# EAGLE design analog (EAGLE 6.5.0)
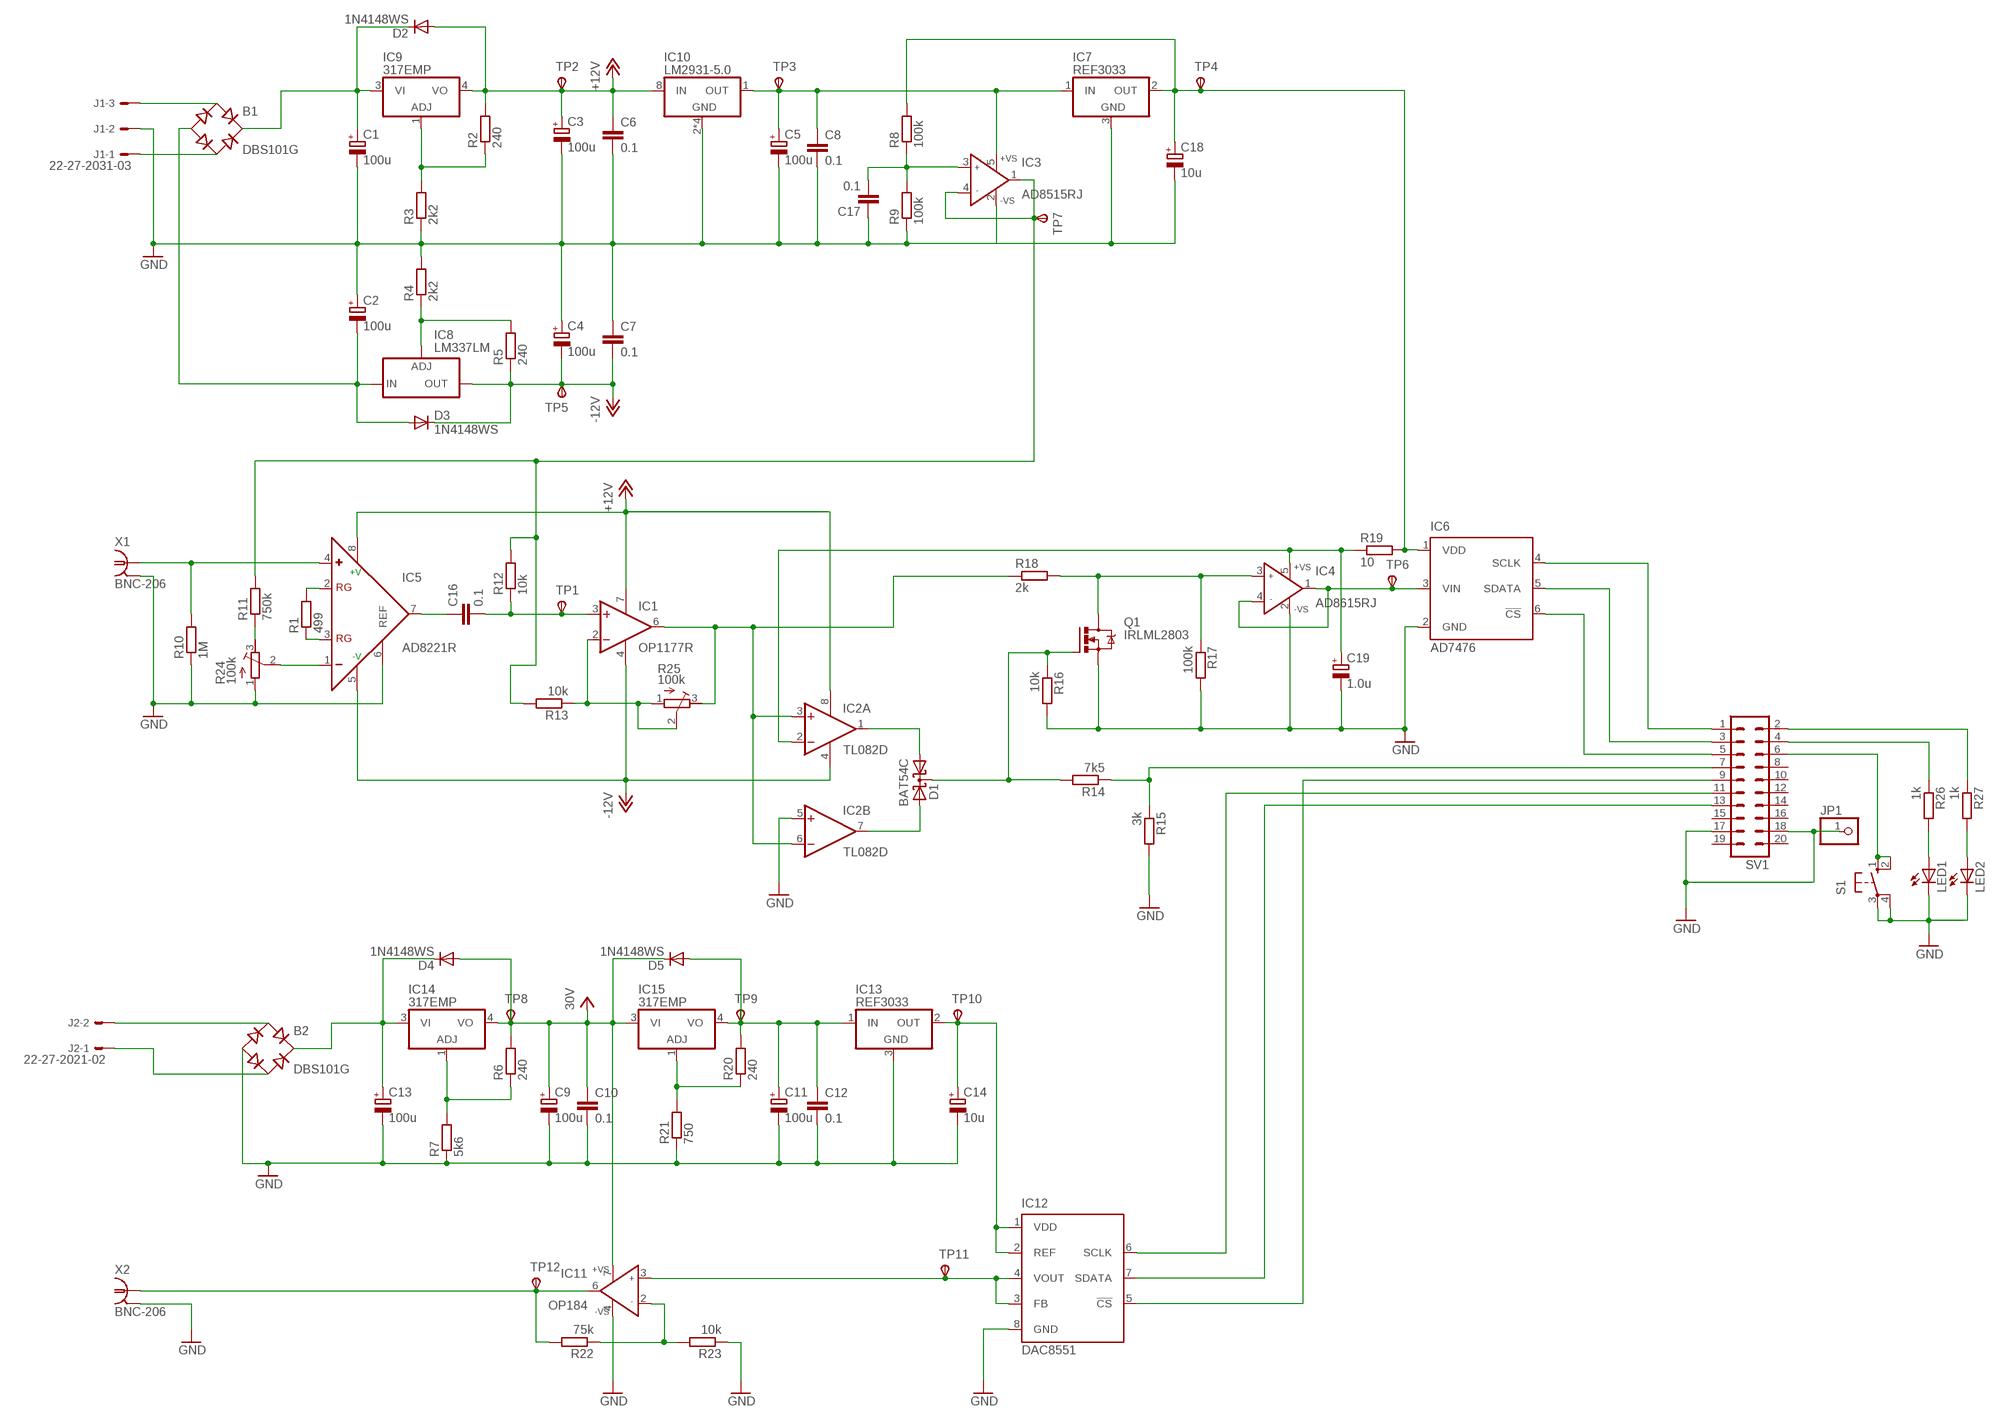
[diagram p0: schematic, sheet 1]

## Parts
B1  DBS101G  [DBS]
B2  DBS101G  [DBS]
C1  100u  CPOL-EUE3.5-8  [E3,5-8]
C2  100u  CPOL-EUE3.5-8  [E3,5-8]
C3  100u  CPOL-EUE2.5-6  [E2,5-6]
C4  100u  CPOL-EUE2.5-6  [E2,5-6]
C5  100u  CPOL-EUE2.5-5  [E2,5-5]
C6  0.1  C-EUC0805K  [C0805K]
C7  0.1  C-EUC0805K  [C0805K]
C8  0.1  C-EUC0603  [C0603]
C9  100u  CPOL-EUE2.5-6  [E2,5-6]
C10  0.1  C-EUC0805K  [C0805K]
C11  100u  CPOL-EUE2.5-5  [E2,5-5]
C12  0.1  C-EUC0603  [C0603]
C13  100u  CPOL-EUE3.5-8  [E3,5-8]
C14  10u  CPOL-EUSMCA  [SMC_A]
C16  0.1  C-EUC0603  [C0603]
C17  0.1  C-EUC0603  [C0603]
C18  10u  CPOL-EUSMCA  [SMC_A]
C19  1.0u  CPOL-EUSMCA  [SMC_A]
D1  BAT54C  [SOT23]
D2  1N4148WS  [SOD323]
D3  1N4148WS  [SOD323]
D4  1N4148WS  [SOD323]
D5  1N4148WS  [SOD323]
IC1  OP1177R  [SOIC8]
IC2  TL082D  [SO08]
IC3  AD8515RJ  [SOT23-5]
IC4  AD8615RJ  [SOT23-5]
IC5  AD8221R  [SO8@1]
IC6  AD7476  [SOT23-6]
IC7  REF3033  [SOT23]
IC8  LM337LM  [SO8]
IC9  317EMP  [SOT223]
IC10  LM2931-5.0  [SO8]
IC11  OP184  [SO8]
IC12  DAC8551  [MSOP8]
IC13  REF3033  [SOT23]
IC14  317EMP  [SOT223]
IC15  317EMP  [SOT223]
J1  22-27-2031-03  [6410-03]
J2  22-27-2021-02  [6410-02]
JP1  PINHD-1X1  [1X01]
LED1  LEDCHIPLED_0805  [CHIPLED_0805]
LED2  LEDCHIPLED_0805  [CHIPLED_0805]
Q1  IRLML2803  [SOT23]
R1  499  R-EU_R0805  [R0805]
R2  240  R-EU_R0805  [R0805]
R3  2k2  R-EU_R0805  [R0805]
R4  2k2  R-EU_R0805  [R0805]
R5  240  R-EU_R0805  [R0805]
R6  240  R-EU_R0805  [R0805]
R7  5k6  R-EU_R0805  [R0805]
R8  100k  R-EU_R0603  [R0603]
R9  100k  R-EU_R0603  [R0603]
R10  1M  R-EU_R0603  [R0603]
R11  750k  R-EU_R0603  [R0603]
R12  10k  R-EU_R0603  [R0603]
R13  10k  R-EU_R0603  [R0603]
R14  7k5  R-EU_R0603  [R0603]
R15  3k  R-EU_R0603  [R0603]
R16  10k  R-EU_R0603  [R0603]
R17  100k  R-EU_R0603  [R0603]
R18  2k  R-EU_R0603  [R0603]
R19  10  R-EU_R0603  [R0603]
R20  240  R-EU_R0603  [R0603]
R21  750  R-EU_R0603  [R0603]
R22  75k  R-EU_R0603  [R0603]
R23  10k  R-EU_R0603  [R0603]
R24  100k  R-TRIMM3296W  [RTRIM3296W]
R25  100k  R-TRIMM3296W  [RTRIM3296W]
R26  1k  R-EU_R0603  [R0603]
R27  1k  R-EU_R0603  [R0603]
S1  10-XX  [B3F-10XX]
SV1  MA10-2W  [MA10-2W]
TP1  TPSB2,54  [B2,54]
TP2  TPSB2,54  [B2,54]
TP3  TPSB2,54  [B2,54]
TP4  TPSB2,54  [B2,54]
TP5  TPSB2,54  [B2,54]
TP6  TPSB2,54  [B2,54]
TP7  TPSB2,54  [B2,54]
TP8  TPSB2,54  [B2,54]
TP9  TPSB2,54  [B2,54]
TP10  TPSB2,54  [B2,54]
TP11  TPSB2,54  [B2,54]
TP12  TPSB2,54  [B2,54]
X1  BNC-206  1-227161-0  [AMP_227161]
X2  BNC-206  1-227161-0  [AMP_227161]

## Nets
30V: C9.+ C10.1 D4.2(A) D5.1(C) IC11.7(+VS) IC14.4(VO) IC15.3(VI) R6.2 TP8.TP(PP)
+3.3V: C18.+ IC6.1(VDD) IC7.2(OUT) R8.2 R19.2 TP4.TP(PP)
+5V: C5.+ C8.1 IC3.5(+VS) IC7.1(IN) IC10.1(OUT) TP3.TP(PP)
+12V: C3.+ C6.1 D2.2(A) IC1.7(V+) IC2.8(P:V+) IC5.8(+V) IC9.4(VO) IC10.8(IN) R2.2 TP2.TP(PP)
-12V: C4.- C7.2 D3.1(C) IC1.4(V-) IC2.4(P:V-) IC5.5(-V) IC8.1(OUT) R5.1 TP5.TP(PP)
GND: B2.- C1.- C2.+ C3.- C4.+ C5.- C6.2 C7.1 C8.2 C9.- C10.2 C11.- C12.2 C13.- C14.- C17.1 C18.- C19.- IC2.5(B:+IN) IC3.2(-VS) IC4.2(-VS) IC5.6(REF) IC6.2(GND) IC7.3(GND) IC10.2(GND) IC10.3(GND) IC10.6(GND) IC10.7(GND) IC11.4(-VS) IC12.8(GND) IC13.3(GND) J1.2 JP1.1 LED1.C LED2.C Q1.2(S) R3.1 R4.2 R7.1 R9.1 R10.1 R15.2 R16.2 R17.2 R21.1 R23.1 R24.1(A) S1.3(P) S1.4(P1) SV1.17 SV1.18 X1.2 X2.2
N$1: IC4.1(OUT) IC4.4(IN-) IC6.3(VIN) TP6.TP(PP)
N$2: IC4.3(IN+) Q1.3(D) R17.1 R18.2
N$3: B1.- C2.- D3.2(A) IC8.2(IN) IC8.3(IN) IC8.6(IN) IC8.7(IN)
N$4: D1.1(A1) IC2.1(A:OUT)
N$5: D1.3(CC) Q1.1(G) R14.2 R16.1
N$6: D1.2(A2) IC2.7(B:OUT)
N$7: R26.1 SV1.4
N$8: R14.1 R15.1 SV1.7
N$9: IC1.6(OUT) IC2.3(A:+IN) IC2.6(B:-IN) R18.1 R25.3(E)
N$10: IC5.2(RG) R1.2
N$11: IC5.3(RG) R1.1
N$12: C16.1 IC5.7(OUT)
N$13: IC1.2(-IN) R13.1 R25.1(A) R25.2(S)
N$14: IC6.4(SCLK) SV1.1
N$15: C16.2 IC1.3(+IN) R12.1 TP1.TP(PP)
N$16: LED1.A R26.2
N$17: IC5.1(-) R24.2(S)
N$18: R11.1 R24.3(E)
N$19: IC5.4(+) R10.2 X1.1
N$20: LED2.A R27.2
N$21: IC6.5(SDATA) SV1.3
N$22: IC6.6(!CS) SV1.5
N$23: B2.AC1 J2.2
N$24: IC8.4(ADJ) R4.1 R5.2
N$25: IC9.1(ADJ) R2.1 R3.2
N$26: R27.1 SV1.2
N$27: C19.+ IC2.2(A:-IN) IC4.5(+VS) R19.1
N$29: IC3.1(OUT) IC3.4(IN-) R11.2 R12.2 R13.2 TP7.TP(PP)
N$30: C17.2 IC3.3(IN+) R8.1 R9.2
N$31: B2.+ C13.+ D4.1(C) IC14.3(VI)
N$32: C11.+ C12.1 D5.2(A) IC13.1(IN) IC15.4(VO) R20.2 TP9.TP(PP)
N$33: IC14.1(ADJ) R6.1 R7.2
N$35: B1.AC1 J1.3
N$36: B1.AC2 J1.1
N$37: IC15.1(ADJ) R20.1 R21.2
N$38: B1.+ C1.+ D2.1(C) IC9.3(VI)
N$39: C14.+ IC12.1(VDD) IC12.2(REF) IC13.2(OUT) TP10.TP(PP)
N$40: IC12.6(SCLK) SV1.11
N$41: IC11.6(OUT) R22.2 TP12.TP(PP) X2.1
N$42: IC12.7(SDATA) SV1.13
N$44: IC11.2(IN-) R22.1 R23.2
N$45: IC12.5(!CS) SV1.9
N$47: IC11.3(IN+) IC12.3(FB) IC12.4(VOUT) TP11.TP(PP)
N$51: B2.AC2 J2.1
N$55: S1.1(S) S1.2(S1) SV1.6
Unconnected: SV1.8 SV1.10 SV1.12 SV1.14 SV1.15 SV1.16 SV1.19 SV1.20

## Library data of the parts
B1 B2 = rectifier:DB?*G: Single Phase 1.0 AMP Glass Passivated Bridge Rectifier Taiwan Semiconductor Co.,Ltd. - TSC Source: http://www.taiwansemi.com/TSCbig5/ezcatfiles/cust/img/img/db101g.pdf http://www.ts.com.tw/db/pictures/modules/PDT/PDT060207001/DBLS201G.pdf
C1-C5 C9 C11 C13 C14 C18 C19 = rcl:CPOL-EU: POLARIZED CAPACITOR, European symbol
C6-C8 C10 C12 C16 C17 = rcl:C-EU: CAPACITOR, European symbol
D1 = diode:BAT54C: Schottky Diodes Source: Fairchild .. BAT54.pdf
D2-D5 = afc-smm:1N4148: DIODE high speed (Philips)
IC1 = linear:OP1177: Precision Low Noise, Low Input Bias Current Operational Amplifiers Source: OP1177_2177_4177.pdf
IC2 = linear:TL082: OP AMP
IC3 = afc-smm:AD8515: General-Purpose CMOS Rail-to-Rail Amplifiers Source: http://www.analog.com/static/imported-files/data_sheets/AD8515.pdf; MF: Analog Devices; MPN: AD8515ARTZ-REEL7; OC_FARNELL: 1464963; OC_NEWARK: 88H0268
IC4 = afc-smm:AD8615: Precission 20 MHz CMOS Rail-to-Rail Amplifiers Source: http://www.analog.com/static/imported-files/data_sheets/AD8615_8616_8618.pdf; MF: ALTERA CORPORATION; MPN: AD8541ARTZ-REEL7; OC_FARNELL: 1464963; OC_NEWARK: 88H0268
IC5 = afc-smm:AD8221: Precision Instrumentation Amplifier; MPN: AD8221; OC_FARNELL: 1464424; OC_NEWARK: 05F7109
IC6 = afc-smm:AD7476
IC7 IC13 = afc-smm:REF3033
IC8 = afc-smm:LM337L: VOLTAGE REGULATOR
IC9 IC14 IC15 = linear:*317: Positive VOLTAGE REGULATOR
IC10 = afc-smm:LM2931-5.0
IC11 = afc-smm:OP184
IC12 = afc-smm:DAC8551
J1 = con-molex:22-?-03: CONNECTOR wire to board 2.54 mm (.1 inch) pitch header; OC_FARNELL: unknown; OC_NEWARK: unknown
J2 = con-molex:22-?-02: CONNECTOR wire to board 2.54 mm (.1 inch) pitch header; OC_FARNELL: unknown; OC_NEWARK: unknown
JP1 = afc-smm:PINHD-1X1: PIN HEADER
LED1 LED2 = led:LED: LED OSRAM: - CHIPLED LG R971, LG N971, LY N971, LG Q971, LY Q971, LO R971, LY R971 LH N974, LH R974 LS Q976, LO Q976, LY Q976 LO Q996 - Hyper CHIPLED LW Q18S LB Q993, LB Q99A, LB R99A - SideLED LS A670, LO A670, LY A670, LG A670, LP A670 LB A673, LV A673, LT A673, LW A673 LH A674 LY A675 LS A676, LA A676, LO A676, LY A676, LW A676 LS A679, LY A679, LG A679 - Hyper Micro SIDELED® LS Y876, LA Y876, LO Y876, LY Y876 LT Y87S - SmartLED LW L88C, LW L88S LB L89C, LB L89S, LG L890 LS L89K, LO L89K, LY L89K LS L896, LA L896, LO L896, LY L896 - TOPLED LS T670, LO T670, LY T670, LG T670, LP T670 LSG T670, LSP T670, LSY T670, LOP T670, LYG T670 LG T671, LOG T671, LSG T671 LB T673, LV T673, LT T673, LW T673 LH T674 LS T676, LA T676, LO T676, LY T676, LB T676, LH T676, LSB T676, LW T676 LB T67C, LV T67C, LT T67C, LS T67K, LO T67K, LY T67K, LW E67C LS E67B, LA E67B, LO E67B, LY E67B, LB E67C, LV E67C, LT E67C LW T67C LS T679, LY T679, LG T679 LS T770, LO T770, LY T770, LG T770, LP T770 LB T773, LV T773, LT T773, LW T773 LH T774 LS E675, LA E675, LY E675, LS T675 LS T776, LA T776, LO T776, LY T776, LB T776 LHGB T686 LT T68C, LB T68C - Hyper Mini TOPLED® LB M676 - Mini TOPLED Santana® LG M470 LS M47K, LO M47K, LY M47K Source: http://www.osram.convergy.de LUXEON: - LUMILED® LXK2-PW12-R00, LXK2-PW12-S00, LXK2-PW14-U00, LXK2-PW14-V00 LXK2-PM12-R00, LXK2-PM12-S00, LXK2-PM14-U00 LXK2-PE12-Q00, LXK2-PE12-R00, LXK2-PE12-S00, LXK2-PE14-T00, LXK2-PE14-U00 LXK2-PB12-K00, LXK2-PB12-L00, LXK2-PB12-M00, LXK2-PB14-N00, LXK2-PB14-P00, LXK2-PB14-Q00 LXK2-PR12-L00, LXK2-PR12-M00, LXK2-PR14-Q00, LXK2-PR14-R00 LXK2-PD12-Q00, LXK2-PD12-R00, LXK2-PD12-S00 LXK2-PH12-R00, LXK2-PH12-S00 LXK2-PL12-P00, LXK2-PL12-Q00, LXK2-PL12-R00 Source: www.luxeon.com KINGBRIGHT: KA-3528ASYC Source: www.kingbright.com
Q1 = afc-smm:IRLML2803
R1-R23 R26 R27 = rcl:R-EU_: RESISTOR, European symbol
R24 R25 = afc-smm:R-TRIMM: Trimm resistor
S1 = switch-omron:10-XX: OMRON SWITCH; MPN: B3F-1000; OC_FARNELL: 176432; OC_NEWARK: 36M3542
SV1 = afc-smm:MA10-2W: PIN HEADER; OC_FARNELL: unknown; OC_NEWARK: unknown
TP1-TP12 = testpad:TPS: TEST PIN
X1 X2 = afc-smm:?227161*: JACK, RIGHT ANGLE, 50 OHM, PCB, BNC Source: amp_227161.pdf; MF: TYCO ELECTRONICS; MPN: 1-227161; OC_FARNELL: unknown; OC_NEWARK: 33B3200

## Board
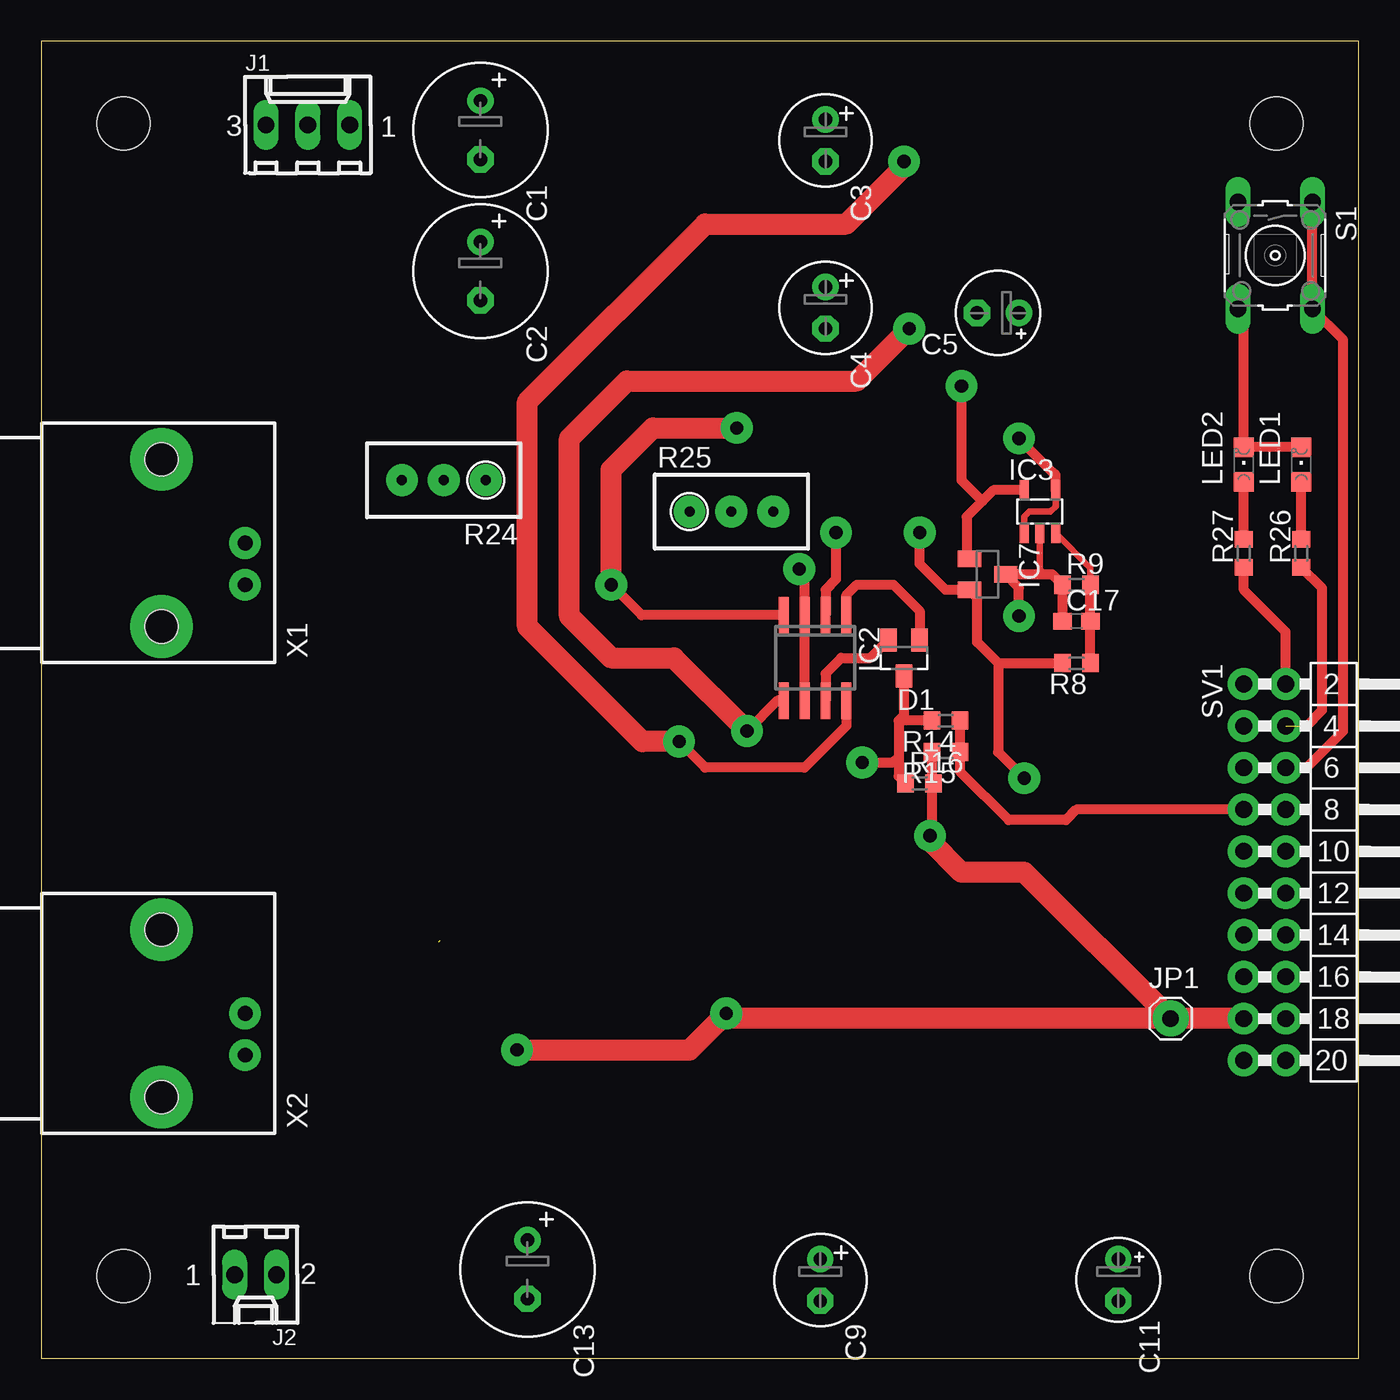
[diagram p1: board, top side]
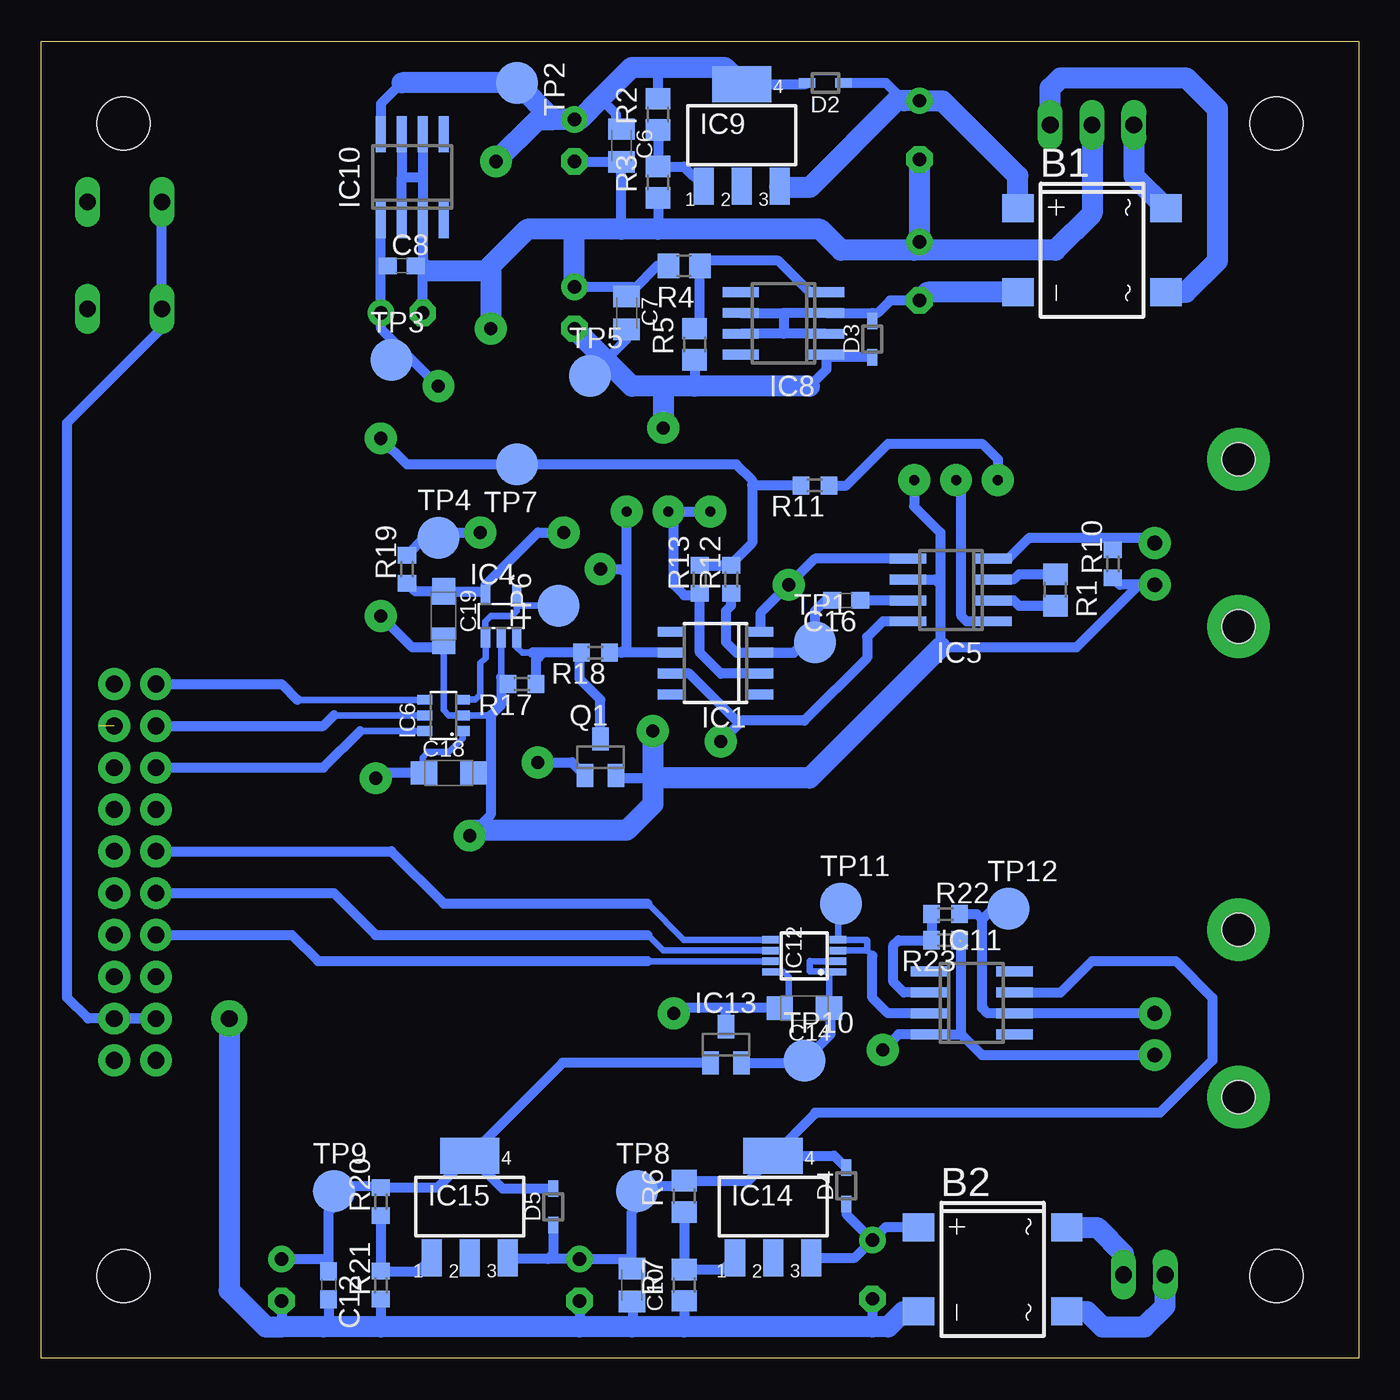
[diagram p2: board, bottom side, seen from below]

Size 80 x 80 mm. Coordinates in mm from the lower left corner, seen from the top.
Outline: 0,0 80,0 80,80 0,80 0,0
Copper layers (1*16): Top 0.035mm / dielectric 1.5mm / Bottom 0.035mm
Design rules "default *": minimum track width 0.3mm, minimum drill 0.6mm, track to track 0.3mm, track to pad 0.4mm, pad to pad 0.4mm, via to via 0.4mm, smd to smd 8mil, copper to edge 40mil, drill to drill 8mil, minimum pad ring 10mil, minimum via ring 8mil, stop-mask expansion 4mil, vias tented up to drill 0mil, thermal gap 10mil
Holes 3.2 mm at 5,5 75,5 75,75 5,75

### Footprints (pad centres in the part's own frame; a part is rotated, then mirrored left to right if it is on the bottom)
DBS = smd 1.7 x 1.9: + -2.55,-4.5; - 2.55,-4.5; AC1 -2.55,4.5; AC2 2.55,4.5
E3,5-8 = drill 0.813 pad 1.6: + -1.778,0 | drill 0.813 pad 1.6 octagon: - 1.778,0
E2,5-6 = drill 0.813 pad 1.6: + -1.27,0 | drill 0.813 pad 1.6 octagon: - 1.27,0
E2,5-5 = drill 0.813 pad 1.6: + -1.27,0 | drill 0.813 pad 1.6 octagon: - 1.27,0
C0805K = smd 1.3 x 1.6: 1 -1,0; 2 1,0
C0603 = smd 1.1 x 1: 1 -0.85,0; 2 0.85,0
SMC_A = smd 1.6 x 1.4: + -1.5,0; - 1.5,0
SOT23 = smd 1 x 1.4: 1 -0.95,-1.1; 2 0.95,-1.1; 3 0,1.1
SOD323 = smd 1 x 0.6: 1 -1.1,0; 2 1.1,0
SOIC8 = smd 0.6 x 1.5: 1 -1.905,-2.75; 2 -0.635,-2.75; 3 0.635,-2.75; 4 1.905,-2.75; 5 1.905,2.75; 6 0.635,2.75; 7 -0.635,2.75; 8 -1.905,2.75
SO08 = smd 0.6 x 2.2: 1 -1.905,-2.6; 2 -0.635,-2.6; 3 0.635,-2.6; 4 1.905,-2.6; 5 1.905,2.6; 6 0.635,2.6; 7 -0.635,2.6; 8 -1.905,2.6
SOT23-5 = smd 0.55 x 1.2: 1 -0.95,-1.3; 2 0,-1.3; 3 0.95,-1.3; 4 0.95,1.3; 5 -0.95,1.3
SO8@1 = smd 0.6 x 2.2: 1 -1.905,-2.6; 2 -0.635,-2.6; 3 0.635,-2.6; 4 1.905,-2.6; 5 1.905,2.6; 6 0.635,2.6; 7 -0.635,2.6; 8 -1.905,2.6
SOT23-6 = smd 0.6 x 0.9: 1 -0.95,-1.15; 2 0,-1.15; 3 0.95,-1.15; 4 0.95,1.15; 5 0,1.15; 6 -0.95,1.15
SO8 = smd 0.6 x 2.2: 1 -1.905,-2.6; 2 -0.635,-2.6; 3 0.635,-2.6; 4 1.905,-2.6; 5 1.905,2.6; 6 0.635,2.6; 7 -0.635,2.6; 8 -1.905,2.6
SOT223 = smd 1.219 x 2.235: 1 -2.311,-3.099; 2 0,-3.099; 3 2.311,-3.099 | smd 3.6 x 2.2: 4 0,3.099
MSOP8 = smd 0.45 x 1: 1 -0.975,-2.05; 2 -0.325,-2.05; 3 0.325,-2.05; 4 0.975,-2.05; 5 0.975,2.05; 6 0.325,2.05; 7 -0.325,2.05; 8 -0.975,2.05
6410-03 = drill 1.016 long: 1 2.54,0; 2 0,0; 3 -2.54,0
6410-02 = drill 1.016 long: 1 1.27,0; 2 -1.27,0
1X01 = drill 1.016 pad 2.184: 1 0,0
CHIPLED_0805 = smd 1.2 x 1.2: A 0,-1.05; C 0,1.05
R0805 = smd 1.3 x 1.5: 1 -0.95,0; 2 0.95,0
R0603 = smd 1 x 1.1: 1 -0.85,0; 2 0.85,0
RTRIM3296W = drill 0.61 pad 1.93: 1 0,-2.54; 2 0,0; 3 0,2.54
B3F-10XX = drill 1.016 long: 1 -3.251,2.261; 2 3.251,2.261; 3 -3.251,-2.261; 4 3.251,-2.261
MA10-2W = drill 1.016 pad 1.93: 1 -11.43,-1.27; 2 -11.43,1.27; 3 -8.89,-1.27; 4 -8.89,1.27; 5 -6.35,-1.27; 6 -6.35,1.27; 7 -3.81,-1.27; 8 -3.81,1.27; 9 -1.27,-1.27; 10 -1.27,1.27; 11 1.27,-1.27; 12 1.27,1.27; 13 3.81,-1.27; 14 3.81,1.27; 15 6.35,-1.27; 16 6.35,1.27; 17 8.89,-1.27; 18 8.89,1.27; 19 11.43,-1.27; 20 11.43,1.27
B2,54 = smd 2.54 x 2.54: TP 0,0
AMP_227161 = drill 0.9 pad 1.93: 1 0,-5.08; 2 -2.54,-5.08 | hole 2: -5.08,0; 5.08,0

### Placement (x,y rotation side)
B1  16.19,67.31 270 bottom
B2  22.23,5.4 270 bottom
C1  26.67,74.61 270 top
C2  26.67,66.04 270 top
C3  47.62,73.98 270 top
C4  47.62,63.82 270 top
C5  58.1,63.5 180 top
C6  44.77,73.66 270 bottom
C7  44.45,63.5 270 bottom
C8  58.1,66.36 0 bottom
C9  47.31,4.76 270 top
C10  44.13,4.45 270 bottom
C11  65.41,4.76 270 top
C12  62.55,4.45 270 bottom
C13  29.53,5.4 270 top
C14  33.66,21.27 180 bottom
C16  31.11,46.04 180 bottom
C17  62.87,44.77 0 top
C18  55.24,35.56 0 bottom
C19  55.56,45.09 270 bottom
D1  52.39,42.55 180 top
D2  32.38,77.47 180 bottom
D3  29.53,61.91 90 bottom
D4  31.11,10.48 90 bottom
D5  48.9,9.21 90 bottom
IC1  39.05,42.23 90 bottom
IC2  46.99,42.55 180 top
IC3  60.64,51.44 0 top
IC4  52.07,45.09 0 bottom
IC5  24.77,46.67 90 bottom
IC6  55.56,39.05 90 bottom
IC7  57.47,47.62 270 top
IC8  34.92,62.87 90 bottom
IC9  37.47,74.3 0 bottom
IC10  57.47,71.75 0 bottom
IC11  23.5,21.59 270 bottom
IC12  33.66,24.45 90 bottom
IC13  38.42,19.05 0 bottom
IC14  35.56,9.21 0 bottom
IC15  53.98,9.21 0 bottom
J1  16.19,74.92 0 top
J2  13.02,5.08 180 top
JP1  68.58,20.64 0 top
LED1  76.52,54.29 0 top
LED2  73.03,54.29 0 top
Q1  46.04,36.51 0 bottom
R1  18.41,46.67 270 bottom
R2  42.55,75.56 90 bottom
R3  42.55,71.44 90 bottom
R4  40.96,66.36 180 bottom
R5  40.32,61.59 90 bottom
R6  40.96,9.84 90 bottom
R7  40.96,4.45 90 bottom
R8  62.87,42.23 180 top
R9  62.87,46.99 0 top
R10  14.92,48.26 90 bottom
R11  33.02,53.02 180 bottom
R12  38.1,47.31 90 bottom
R13  40.01,47.31 90 bottom
R14  54.93,38.73 180 top
R15  54.93,36.83 180 top
R16  53.34,34.92 0 top
R17  50.8,40.96 180 bottom
R18  46.35,42.86 180 bottom
R19  57.78,47.94 90 bottom
R20  59.37,9.53 90 bottom
R21  59.37,4.45 90 bottom
R22  25.08,26.99 0 bottom
R23  25.08,25.4 180 bottom
R24  24.45,53.34 90 top
R25  41.91,51.44 270 top
R26  76.52,48.9 90 top
R27  73.03,48.9 90 top
S1  74.93,66.99 270 top
SV1  74.3,29.53 270 top
TP1  33.02,43.5 0 bottom
TP2  51.12,77.47 270 bottom
TP3  58.74,60.64 0 bottom
TP4  55.88,49.85 0 bottom
TP5  46.67,59.69 0 bottom
TP6  48.58,45.72 90 bottom
TP7  51.12,54.29 180 bottom
TP8  43.81,10.16 0 bottom
TP9  62.23,10.16 0 bottom
TP10  33.66,18.1 0 bottom
TP11  31.43,27.62 0 bottom
TP12  21.27,27.3 0 bottom
X1  7.3,49.53 90 top
X2  7.3,20.95 90 top

### Tracks (layer width: path | path; a pad name or v marks a point on that pad's centre or on a via)
30V
  Bottom 0.61: C10.1 44.13,6.03 | 44.13,6.03 44.13,8.89 43.34,9.68 | 43.34,9.68 42.55,10.48 41.27,10.48 R6.2 37.07,10.79 IC14.4 | IC14.4 31.84,12.31 D4.2 | TP8.TP 43.34,9.68 | IC11.7 18.1,22.23 16.19,24.13 11.11,24.13 8.89,21.91 8.89,18.1 12.06,14.92 33.02,14.92 33.02,14.85 IC14.4 | 49.21,6.03 C9.+ 44.13,6.03 | 49.21,6.03 51.59,6.03 IC15.3 | D5.1 48.9,6.35 49.21,6.03
+3.3V  (via drill 0.8 pad 1.93)
  Top 0.61: v53.34,50.16 53.34,48.26 54.92,46.67 IC7.2 56.83,46.21 56.83,43.5 58.1,42.23 | 58.1,42.23 R8.2 | 58.1,42.23 58.1,36.83 v59.69,35.24
  Bottom 0.406: IC6.1 54.41,37.66 55.24,36.83 56.52,36.83 56.83,36.51 56.83,35.65 C18.+
  Bottom 0.61: v53.34,50.16 55.56,50.16 TP4.TP 56.73,49.85 R19.2 | C18.+ 59.37,35.56 v59.69,35.24
+5V  (via drill 0.8 pad 1.93)
  Top 0.61: IC3.5 57.81,52.73 57.15,52.07 | 57.15,52.07 56.2,51.12 56.2,48.74 IC7.1 | v55.88,59.05 55.88,53.34 57.15,52.07
  Bottom 0.406: C8.1 59.37,66.36
  Bottom 0.61: 58.1,61.28 59.37,62.55 C5.+ 59.37,66.36 IC10.1 | 58.1,61.28 v55.88,59.05 | TP3.TP 58.1,61.28
+12V  (via drill 0.8 pad 1.93)
  Top 0.61: IC2.8 48.9,38.42 46.35,35.88 40.32,35.88 v38.73,37.47
  Top 1.27: v38.73,37.47 36.51,37.47 29.53,44.45 29.53,58.1 40.32,68.9 48.9,68.9 52.39,72.39 v52.39,72.71
  Bottom 0.61: 37.62,38.58 40.64,41.59 IC1.7 | v38.73,37.47 37.62,38.58 | IC5.8 28.89,44.77 29.84,43.81 29.84,42.55 33.66,38.73 37.47,38.73 37.62,38.58 | C6.1 45.09,74.98 45.09,75.56 46.04,76.52 | 58.1,77.47 59.37,76.2 IC10.8 | IC9.4 33.56,77.39 D2.2 | R2.2 42.55,78.42
  Bottom 1.27: 58.1,77.47 TP2.TP 48.9,75.25 | IC9.4 38.49,78.42 42.55,78.42 44.13,78.42 46.04,76.52 47.31,75.25 C3.+ 48.9,75.25 | v52.39,72.71 49.85,75.25 48.9,75.25
-12V  (via drill 0.8 pad 1.93)
  Top 0.61: IC2.4 36.45,45.15 v34.61,46.99
  Top 1.27: v34.61,46.99 34.61,53.98 37.15,56.52 v42.23,56.52
  Bottom 0.61: D3.1 32.18,60.81 IC8.1 32.33,60.07 33.34,59.05 | 47.58,62.5 C4.- | IC5.5 33.02,48.58 v34.61,46.99 36.3,45.3 IC1.4 | R5.1 40.32,59.05 | C7.2 44.45,61.91 45.72,60.64 TP5.TP
  Bottom 1.27: 33.34,59.05 40.32,59.05 42.23,59.05 | 42.23,59.05 v42.23,56.52 | 42.23,59.05 44.13,59.05 45.72,60.64 C4.-
GND  (via drill 0.8 pad 1.93)  (1 unrouted)
  Top 0.406: IC3.2 60.64,47.94 60.96,47.62
  Top 0.61: 61.91,47.09 R9.1 | R9.1 C17.1 | R9.1 61.38,47.62 60.96,47.62 IC7.3 59.37,46.82 v59.37,45.09 | IC2.5 44.71,39.95 v42.86,38.1 | R15.2 54.08,35.04 | 54.08,35.04 R16.2 | 54.08,35.04 54.08,31.85 v53.98,31.75 | v41.59,20.95 41.27,20.64 41.12,20.48 | LED1.C LED2.C 73.03,63.39 S1.4
  Top 1.27: SV1.17 JP1.1 | JP1.1 41.27,20.64 | v42.86,38.1 38.42,42.55 34.61,42.55 32.07,45.09 32.07,55.88 35.56,59.37 49.53,59.37 v52.7,62.55 | v28.89,18.73 39.37,18.73 41.12,20.48 | JP1.1 59.69,29.53 55.88,29.53 53.98,31.43 v53.98,31.75
  Bottom 0.406: C19.- 55.56,39.37 55.24,39.05 IC6.2 52.7,39.05 | IC4.2 52.07,41.38 R17.2 | IC12.8 34.9,23.47 34.61,23.18 34.61,21.82 C14.- | C8.2 56.83,66.36
  Bottom 0.61: C19.- 55.97,43.18 57.47,43.18 v59.37,45.09 | 25.4,46.99 25.4,43.18 17.14,43.18 13.34,46.99 | 24.13,19.68 IC11.4 27.94,19.68 v28.89,18.73 | 44.77,68.58 C6.2 47.58,72.66 C3.- | R4.2 42.59,66.36 44,64.95 | 44,64.95 C7.1 | IC10.6 56.83,71.75 | 56.83,71.75 IC10.3 56.83,66.78 56.88,66.73 56.83,66.67 | C10.2 44.08,3.5 44.08,1.96 44.13,1.91 | X1.2 13.34,46.99 | 13.34,46.99 14.5,46.99 R10.1 | IC5.6 25.72,47.31 25.4,46.99 | R24.1 26.99,51.75 25.4,50.16 25.4,46.99 | IC10.2 58.1,71.75 | 58.1,71.75 56.83,71.75 | IC10.7 58.1,71.75 | Q1.2 44.92,35.24 42.86,35.24 42.55,35.24 | 52.07,41.38 52.07,39.69 52.7,39.05 52.7,35.56 | C18.- 52.7,35.56 | X2.2 22.86,18.41 24.13,19.68 | 24.13,19.68 24.13,25.3 | C14.- 38.42,21.27 | 38.42,21.27 41.27,21.27 v41.59,20.95 | SV1.18 SV1.17 77.15,20.64 78.42,21.91 78.42,56.83 72.67,62.59 S1.4 72.71,63.78 72.67,63.78 S1.3 | C2.+ 26.67,67.63 26.99,67.31 | R3.1 42.55,68.58 42.86,68.26 47.62,68.26 | C13.- 29.53,1.91 | R7.1 40.96,1.91 | C9.- 47.31,1.91 | R21.1 59.37,1.91 | C12.2 62.55,2.22 62.87,1.91 | C11.- 65.41,1.91 | IC13.3 38.42,21.27 | C5.- 56.83,66.36 56.83,66.67 | 56.52,66.04 56.52,66.36 56.83,66.67 | 52.7,35.56 52.7,33.02 v53.98,31.75 | C4.+ 44.13,65.09 44,64.95
  Bottom 1.27: C1.- C2.+ | 25.4,43.18 33.34,35.24 42.55,35.24 | J1.2 16.19,69.53 18.41,67.31 26.99,67.31 31.43,67.31 32.7,68.58 42.55,68.58 44.77,68.58 50.48,68.58 52.7,66.36 52.7,66.04 | 52.7,66.04 56.52,66.04 | B2.- 27.63,2.85 28.57,1.91 29.53,1.91 40.96,1.91 44.13,1.91 47.31,1.91 59.37,1.91 62.87,1.91 65.41,1.91 66.36,1.91 68.58,4.13 JP1.1 | v42.86,38.1 42.86,35.24 42.86,33.66 44.45,32.07 53.66,32.07 v53.98,31.75 | 52.7,66.04 v52.7,62.55 | C4.+ 47.62,68.26
N$1
  Bottom 0.406: IC4.4 51.12,45.72 | 51.12,45.72 51.12,45.4 51.44,45.09 52.7,45.09 53.02,44.77 IC4.1 53.02,42.55 53.34,42.23 53.34,40.32 53.66,40.01 IC6.3 | TP6.TP 51.12,45.72
N$2
  Bottom 0.406: IC4.3 51.12,43.18 50.8,42.86 50.2,42.86
  Bottom 0.61: 49.53,42.86 R18.2 47.31,42.76 47.31,41.27 46.04,40.01 Q1.3 | 49.53,42.86 50.2,42.86 | R17.1 49.95,42.44 49.53,42.86
N$3
  Bottom 0.61: 26.49,64.44 C2.- 28.45,64.26 29.21,63.5 29.53,63.5 | 29.53,63.5 IC8.3 34.92,63.5 | IC8.2 34.92,62.23 | 34.92,62.23 IC8.7 | 34.92,63.5 34.92,62.23 | IC8.6 34.92,63.5 | D3.2 29.53,63.5
  Bottom 1.27: B1.- 26.17,64.76 C2.-
N$4
  Top 0.61: IC2.1 48.9,46.35 49.53,46.99 51.75,46.99 53.34,45.4 D1.1
N$5  (via drill 0.8 pad 1.93)
  Top 0.61: 52.07,38.73 52.07,36.51 | 52.07,36.51 52.07,35.34 R16.1 | R14.2 52.07,38.73 | v49.85,36.2 51.75,36.2 52.07,36.51 | D1.3 52.39,39.05 52.07,38.73
  Bottom 0.61: v49.85,36.2 47.77,36.2 Q1.1
N$6
  Top 0.61: IC2.7 47.62,41.59 48.58,42.55 50.34,42.55 D1.2
N$7  (1 unrouted)
  Top 0.61: 76.52,38.42 76.83,38.42 77.79,39.37 77.79,46.77 R26.1
N$8
  Top 0.61: R14.1 R15.1 55.78,35.66 58.74,32.7 62.23,32.7 62.87,33.34 SV1.7
N$9  (via drill 0.8 pad 1.93)
  Top 0.61: IC2.6 IC2.3 46.35,47.62 v46.04,47.94
  Bottom 0.61: IC1.6 44.77,42.86 | 44.77,42.86 R18.1 | 44.77,42.86 44.45,43.18 44.45,47.62 | 44.45,47.62 R25.3 | v46.04,47.94 44.77,47.94 44.45,47.62
N$10
  Bottom 0.61: IC5.2 20.95,46.04 20.64,45.72 R1.2
N$11
  Bottom 0.61: R1.1 20.64,47.62 20.95,47.31 IC5.3
N$12
  Bottom 0.61: IC5.7 C16.1
N$13
  Bottom 0.61: IC1.2 38.73,41.59 40.01,42.86 R13.1 40.11,46.35 40.96,46.35 41.59,46.99 41.59,51.12 R25.2 R25.1
N$14
  Bottom 0.406: IC6.4 64.45,40
  Bottom 0.61: SV1.1 65.41,40.96 64.45,40
N$15
  Bottom 0.61: R12.1 38.1,45.72 38.42,45.4 38.42,43.5 37.78,42.86 IC1.3 34.29,42.86 33.34,43.81 TP1.TP 33.02,45.4 32.38,46.04 C16.2
N$16
  Top 0.61: R26.2 LED1.A
N$17
  Bottom 0.61: IC5.1 23.81,44.77 24.13,45.09 24.13,53.02 R24.2
N$18
  Bottom 0.61: 22.01,53.44 R24.3 21.91,54.61 22.86,55.56 28.57,55.56 31.11,53.02 R11.1
N$19
  Bottom 0.61: IC5.4 21.27,48.58 20,49.85 14.92,49.85 | 14.92,49.85 12.7,49.85 X1.1 | R10.2 14.92,49.85
N$20
  Top 0.61: R27.2 LED2.A
N$21
  Bottom 0.406: IC6.5 62.23,39.05
  Bottom 0.61: SV1.3 62.87,38.42 62.23,39.05
N$22
  Bottom 0.406: IC6.6 60.64,38.1
  Bottom 0.61: SV1.5 62.87,35.88 60.64,38.1
N$23
  Bottom 1.27: B2.AC1 15.88,7.95 14.29,6.35 J2.2
N$24
  Bottom 0.61: IC8.4 33.34,64.77 35.24,66.67 39.69,66.67 R4.1 40.01,62.86 R5.2
N$25
  Bottom 0.61: IC9.1 40.97,72.39 R3.2 R2.1
N$26
  Top 0.61: SV1.2 75.56,44.13 73.03,46.67 R27.1
N$27  (via drill 0.8 pad 1.93)
  Top 0.61: v48.26,50.16 48.26,47.31 47.62,46.67 IC2.2
  Bottom 0.61: v48.26,50.16 49.85,50.16 53.02,46.99 IC4.5 53.22,46.59 C19.+ 57.28,46.59 R19.1
N$28  (via drill 1 pad 3.81)
  other vias: 7.3,54.61
N$29  (via drill 0.8 pad 1.93)
  Top 0.406: IC3.1 59.69,51.12 60.01,51.44 61.28,51.44 61.59,51.75 IC3.4
  Top 0.61: 61.59,53.66 | v59.37,55.88 61.44,53.82 61.59,53.66 | IC3.4 61.59,53.66
  Bottom 0.61: R12.2 R13.2 38.2,48.16 36.83,49.53 36.83,53.02 | 36.83,53.02 36.83,53.34 37.78,54.29 50.8,54.29 TP7.TP 57.78,54.29 v59.37,55.88 | R11.2 36.83,53.02
N$30
  Top 0.406: IC3.3 63.72,48.01 R9.2
  Top 0.61: R8.1 C17.2 R9.2 63.82,46.99
N$31
  Bottom 0.61: D4.1 31.11,8.76 C13.+ | IC14.3 30.59,6.11 C13.+ | C13.+ 28.76,7.95 B2.+
N$32
  Bottom 0.61: C11.+ 62.65,6.03 C12.1 62.55,8.89 61.75,9.68 | 61.75,9.68 60.96,10.48 60.11,10.48 R20.2 55.91,10.38 IC15.4 | D5.2 51.98,10.31 IC15.4 | TP9.TP 61.75,9.68 | IC13.1 48.33,17.95 IC15.4
N$33
  Bottom 0.61: R6.1 R7.2 38.59,5.39 IC14.1
N$35
  Bottom 1.27: J1.3 13.65,71.82 B1.AC1
N$36
  Bottom 1.27: J1.1 18.73,77.15 18.1,77.79 10.48,77.79 8.57,75.88 8.57,66.67 10.49,64.76 B1.AC2
N$37
  Bottom 0.61: R20.1 R21.2 57.1,5.29 IC15.1
N$38
  Bottom 0.61: B1.+ 20.01,69.54 | D2.1 28.7,77.47 27.62,76.39
  Bottom 1.27: B1.+ 20.69,71.81 25.27,76.39 C1.+ 27.62,76.39 28.07,76.39 33.34,71.12 35.08,71.12 IC9.3
N$39
  Bottom 0.406: IC12.2 33.01,24.12 33.34,24.13 33.34,23.5 32.07,23.5 | C14.+ 32.16,23.41 32.07,23.5 | 32.07,23.5 31.63,23.5 IC12.1
  Bottom 0.61: C14.+ 32.07,21.18 32.07,19.68 TP10.TP 33.8,17.95 IC13.2
N$40
  Bottom 0.406: 42.23,24.77 | 43.18,25.72 42.55,25.08 42.23,24.77 | IC12.6 42.23,24.77
  Bottom 0.61: SV1.11 62.23,28.26 59.69,25.72 43.18,25.72
N$41
  Bottom 0.61: X2.1 IC11.6 22.54,20.95 22.86,21.27 22.86,26.67 | R22.2 23.18,26.99 22.86,26.67 | TP12.TP 22.23,27.3 22.86,26.67
N$42
  Bottom 0.406: IC12.7 43.17,24.12 43.18,24.13
  Bottom 0.61: SV1.13 64.77,25.72 63.18,24.13 43.18,24.13
N$43  (via drill 1 pad 3.81)
  other vias: 7.3,44.45
N$44
  Bottom 0.61: 26.04,25.5 R23.2 | IC11.2 27.62,22.23 28.26,22.86 28.26,25.08 27.94,25.4 R23.2 | R22.1 R23.2
N$45
  Bottom 0.406: IC12.5 40.98,25.42 43.18,27.62
  Bottom 0.61: SV1.9 58.74,30.8 55.56,27.62 43.18,27.62
N$46  (via drill 1 pad 3.81)
  other vias: 7.3,26.04
N$47
  Bottom 0.406: IC12.3 29.85,24.77 | 29.84,24.77 29.85,24.77 | 29.85,24.77 29.53,24.45 | TP11.TP 31.61,27.45 IC12.4 29.87,25.42 29.84,25.4 29.84,24.78 29.85,24.77
  Bottom 0.61: IC11.3 26.1,20.96 28.58,20.96 29.53,21.91 29.53,24.45
N$48  (via drill 1 pad 3.81)
  other vias: 7.3,15.88
N$49  (via drill 0.8 pad 1.93)
  other vias: 5,5
N$50  (via drill 0.8 pad 1.93)
  other vias: 5,75
N$51
  Bottom 1.27: B2.AC2 16.5,2.85 15.56,1.91 13.02,1.91 11.75,3.17 J2.1
N$52  (via drill 0.8 pad 1.93)
  other vias: 75,75
N$53  (via drill 0.8 pad 1.93)
  other vias: 75,5
N$55
  Top 0.61: SV1.6 76.83,35.88 79.06,38.1 79.06,61.87 S1.2 S1.1